# Altium schematic sheet Efuse.SchDoc
size A3
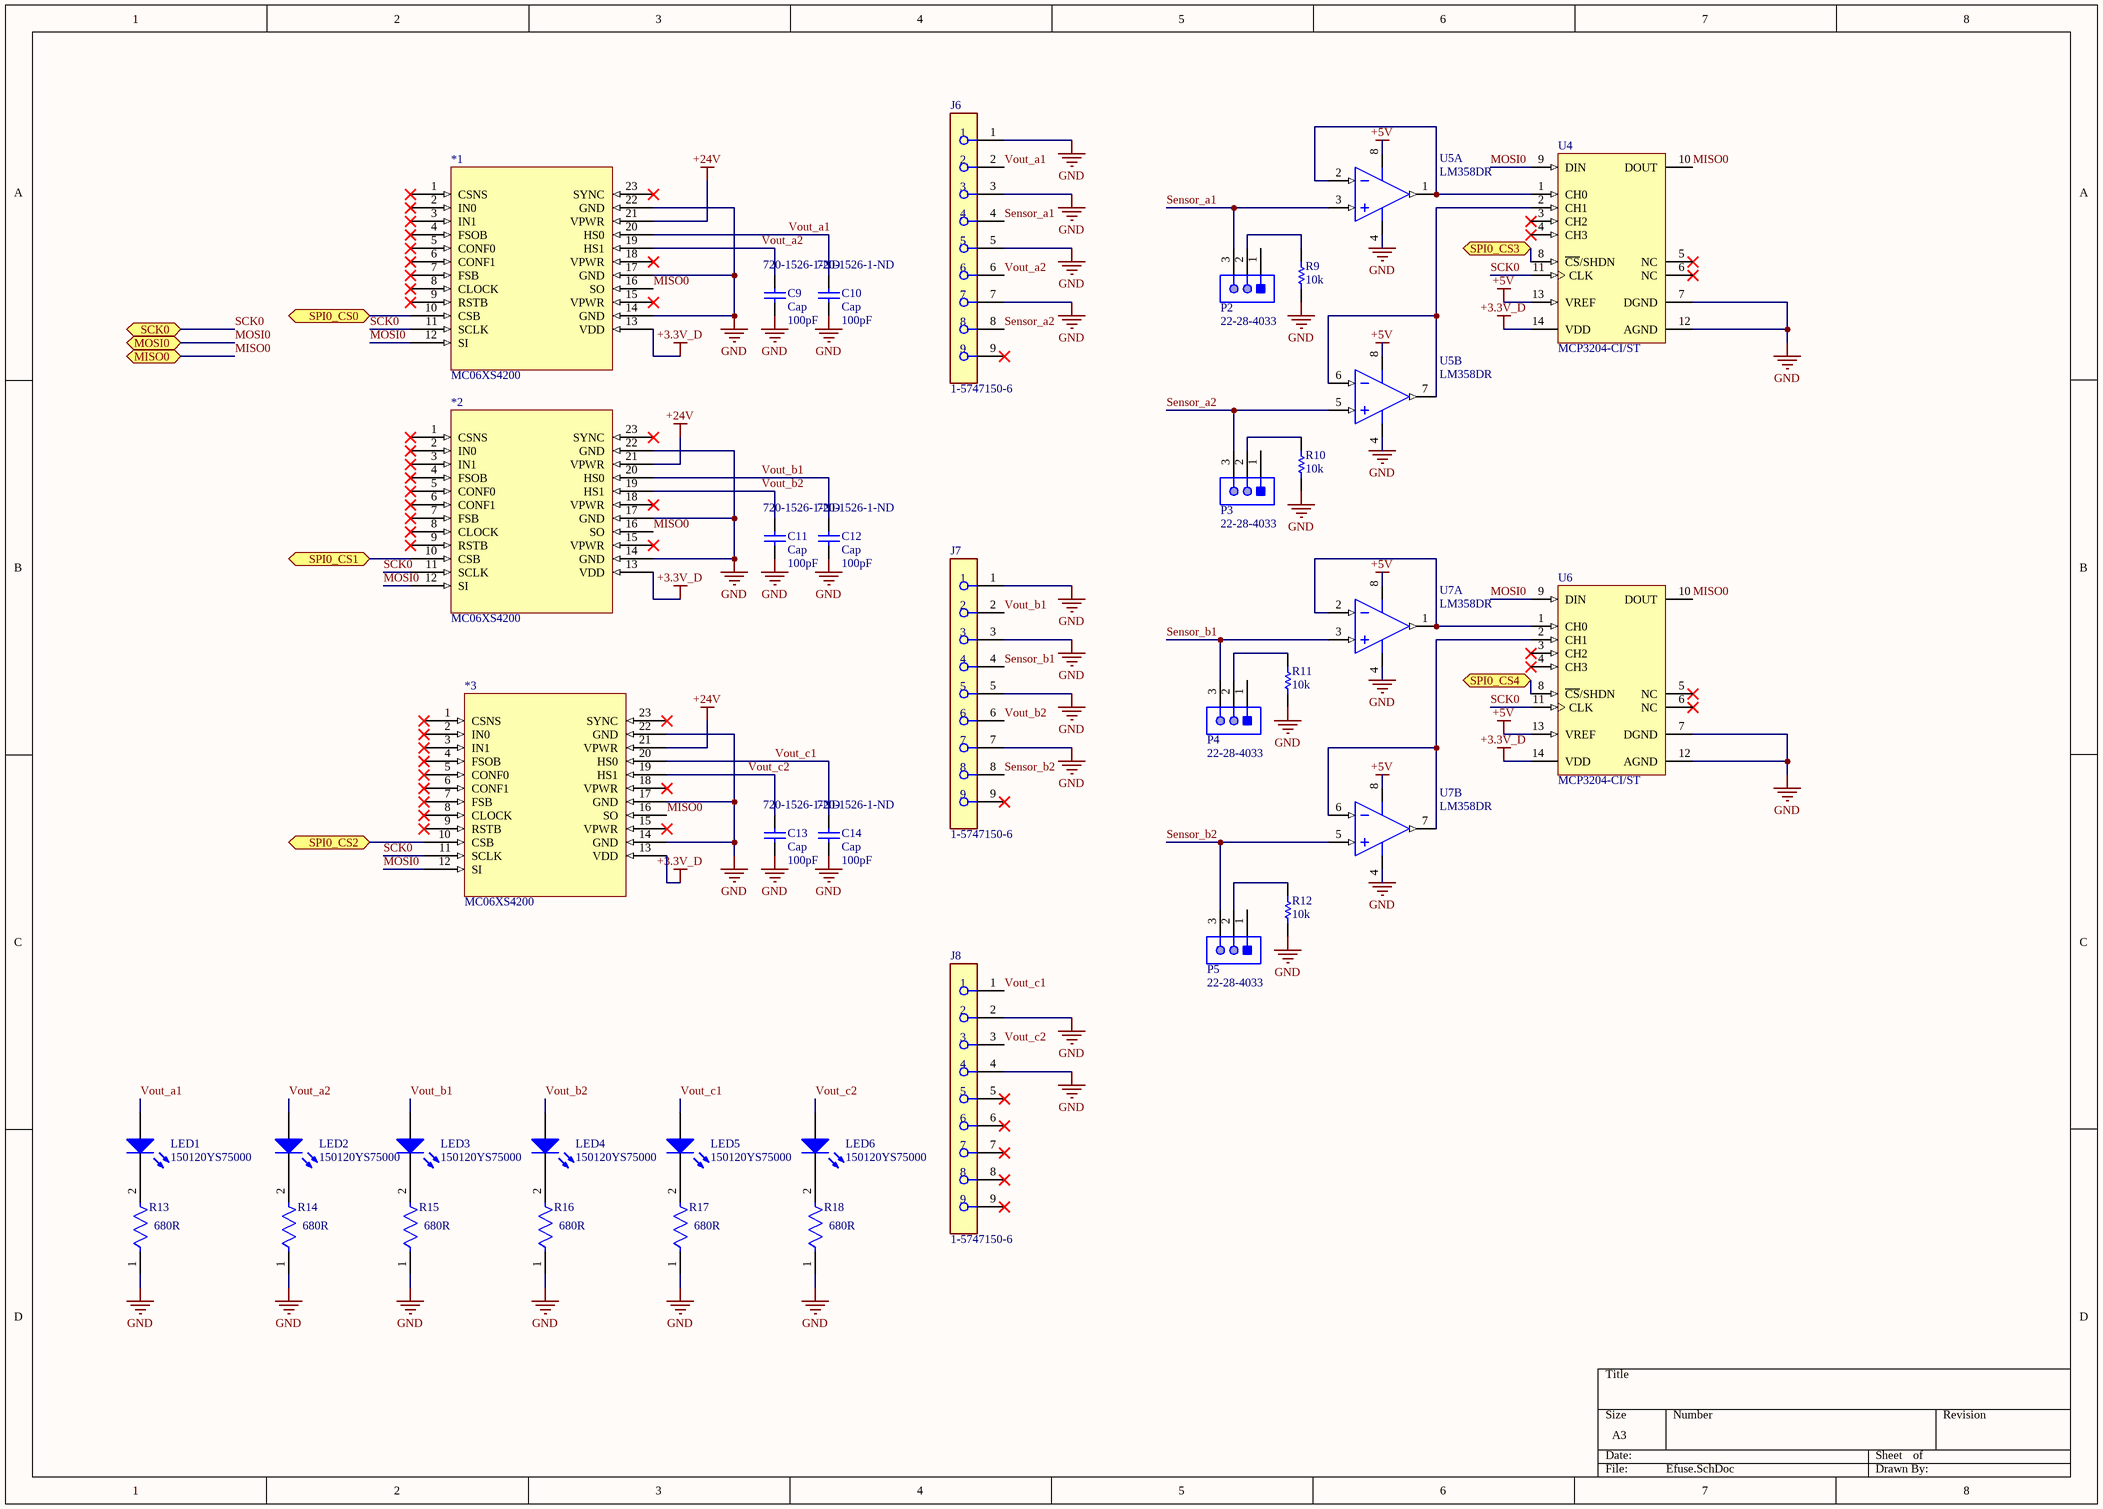
[diagram p0: Efuse.SchDoc]

## Parts
*1  MC06XS4200  [PQFN50P1200X1200X220_HS-33N]
*2  MC06XS4200  [PQFN50P1200X1200X220_HS-33N]
*3  MC06XS4200  [PQFN50P1200X1200X220_HS-33N]
C9  Cap  value 100pF  Supplier Part Number 1: 720-1526-1-ND  [CAPC1608X95X40LL15T15]
C10  Cap  value 100pF  Supplier Part Number 1: 720-1526-1-ND  [CAPC1608X95X40LL15T15]
C11  Cap  value 100pF  Supplier Part Number 1: 720-1526-1-ND  [CAPC1608X95X40LL15T15]
C12  Cap  value 100pF  Supplier Part Number 1: 720-1526-1-ND  [CAPC1608X95X40LL15T15]
C13  Cap  value 100pF  Supplier Part Number 1: 720-1526-1-ND  [CAPC1608X95X40LL15T15]
C14  Cap  value 100pF  Supplier Part Number 1: 720-1526-1-ND  [CAPC1608X95X40LL15T15]
J6  1-5747150-6  [FP-1-5747150-6-MFG]
J7  1-5747150-6  [FP-1-5747150-6-MFG]
J8  1-5747150-6  [FP-1-5747150-6-MFG]
LED1  150120YS75000  [1206_A]
LED2  150120YS75000  [1206_A]
LED3  150120YS75000  [1206_A]
LED4  150120YS75000  [1206_A]
LED5  150120YS75000  [1206_A]
LED6  150120YS75000  [1206_A]
P2  22-28-4033  [MOLX-22-28-4033_V]
P3  22-28-4033  [MOLX-22-28-4033_V]
P4  22-28-4033  [MOLX-22-28-4033_V]
P5  22-28-4033  [MOLX-22-28-4033_V]
R9  10k  [RESC1005X40X25NL05T05]
R10  10k  [RESC1005X40X25NL05T05]
R11  10k  [RESC1005X40X25NL05T05]
R12  10k  [RESC1005X40X25NL05T05]
R13  Resistance: 680R  [FP-CRCW0603-e3-MFG]  (hidden comment: CRCW0603680RFKEA)
R14  Resistance: 680R  [FP-CRCW0603-e3-MFG]  (hidden comment: CRCW0603680RFKEA)
R15  Resistance: 680R  [FP-CRCW0603-e3-MFG]  (hidden comment: CRCW0603680RFKEA)
R16  Resistance: 680R  [FP-CRCW0603-e3-MFG]  (hidden comment: CRCW0603680RFKEA)
R17  Resistance: 680R  [FP-CRCW0603-e3-MFG]  (hidden comment: CRCW0603680RFKEA)
R18  Resistance: 680R  [FP-CRCW0603-e3-MFG]  (hidden comment: CRCW0603680RFKEA)
U4  MCP3204-CI/ST  [TSSOP-ST14_N]
U5  LM358DR  [D0008A_L]  (parts A,B of 2)
U6  MCP3204-CI/ST  [TSSOP-ST14_N]
U7  LM358DR  [D0008A_L]  (parts A,B of 2)

## Ports
MISO0 (bidir), MOSI0 (bidir), SCK0 (bidir), SPI0_CS0 (bidir), SPI0_CS1 (bidir), SPI0_CS2 (bidir), SPI0_CS3 (bidir), SPI0_CS4 (bidir)

## Nets
+3.3V_D: *1.13(VDD) *2.13(VDD) *3.13(VDD) U4.14(VDD) U6.14(VDD)
+5V: U4.13(VREF) U5.8(VCC) U6.13(VREF) U7.8(VCC)
+24V: *1.21(VPWR) *2.21(VPWR) *3.21(VPWR)
GND: *1.14(GND) *1.17(GND) *1.22(GND) *2.14(GND) *2.17(GND) *2.22(GND) *3.14(GND) *3.17(GND) *3.22(GND) C9.1 C10.1 C11.1 C12.1 C13.1 C14.1 J6.1 J6.3 J6.5 J6.7 J7.1 J7.3 J7.5 J7.7 J8.2 J8.4 R9.1 R10.1 R11.1 R12.1 R13.1 R14.1 R15.1 R16.1 R17.1 R18.1 U4.7(DGND) U4.12(AGND) U5.4(GND) U6.7(DGND) U6.12(AGND) U7.4(GND)
MISO0: *1.16(SO) *2.16(SO) *3.16(SO) U4.10(DOUT) U6.10(DOUT) ; port MISO0
MOSI0: *1.12(SI) *2.12(SI) *3.12(SI) U4.9(DIN) U6.9(DIN) ; port MOSI0
SCK0: *1.11(SCLK) *2.11(SCLK) *3.11(SCLK) U4.11(CLK) U6.11(CLK) ; port SCK0
Sensor_a1: J6.4 P2.3 U5.3(1IN+)
Sensor_a2: J6.8 P3.3 U5.5(2IN+)
Sensor_b1: J7.4 P4.3 U7.3(1IN+)
Sensor_b2: J7.8 P5.3 U7.5(2IN+)
SPI0_CS0: *1.10(CSB) ; port SPI0_CS0
SPI0_CS1: *2.10(CSB) ; port SPI0_CS1
SPI0_CS2: *3.10(CSB) ; port SPI0_CS2
SPI0_CS3: U4.8(~{CS}/SHDN) ; port SPI0_CS3
SPI0_CS4: U6.8(~{CS}/SHDN) ; port SPI0_CS4
Vout_a1: *1.20(HS0) C10.2 J6.2 LED1.2(A)
Vout_a2: *1.19(HS1) C9.2 J6.6 LED2.2(A)
Vout_b1: *2.20(HS0) C12.2 J7.2 LED3.2(A)
Vout_b2: *2.19(HS1) C11.2 J7.6 LED4.2(A)
Vout_c1: *3.20(HS0) C14.2 J8.1 LED5.2(A)
Vout_c2: *3.19(HS1) C13.2 J8.3 LED6.2(A)
NetLED1_1: LED1.1(K) R13.2
NetLED2_1: LED2.1(K) R14.2
NetLED3_1: LED3.1(K) R15.2
NetLED4_1: LED4.1(K) R16.2
NetLED5_1: LED5.1(K) R17.2
NetLED6_1: LED6.1(K) R18.2
NetP2_2: P2.2 R9.2
NetP3_2: P3.2 R10.2
NetP4_2: P4.2 R11.2
NetP5_2: P5.2 R12.2
NetU4_1: U4.1(CH0) U5.1(1OUT) U5.2(1IN-)
NetU4_2: U4.2(CH1) U5.6(2IN-) U5.7(2OUT)
NetU6_1: U6.1(CH0) U7.1(1OUT) U7.2(1IN-)
NetU6_2: U6.2(CH1) U7.6(2IN-) U7.7(2OUT)

Not connected (* = marked no-connect by the designer): *1 1(CSNS)* 2(IN0)* 3(IN1)* 4(FSOB)* 5(CONF0)* 6(CONF1)* 7(FSB)* 8(CLOCK)* 9(RSTB)* 15(VPWR)* 18(VPWR)* 23(SYNC)*; *2 1(CSNS)* 2(IN0)* 3(IN1)* 4(FSOB)* 5(CONF0)* 6(CONF1)* 7(FSB)* 8(CLOCK)* 9(RSTB)* 15(VPWR)* 18(VPWR)* 23(SYNC)*; *3 1(CSNS)* 2(IN0)* 3(IN1)* 4(FSOB)* 5(CONF0)* 6(CONF1)* 7(FSB)* 8(CLOCK)* 9(RSTB)* 15(VPWR)* 18(VPWR)* 23(SYNC)*; J6 9*; J7 9*; J8 5* 6* 7* 8* 9*; P2 1; P3 1; P4 1; P5 1; U4 3(CH2)* 4(CH3)* 5(NC)* 6(NC)*; U6 3(CH2)* 4(CH3)* 5(NC)* 6(NC)*

## Library data of the parts
C9-C14 = Cap: MULTICOMP - MC0603F223Z500CT - KONDENSATOR, 0.022µF, 50V, Y5V, 0603; Tolerance: -20%; Capacitance: 22nF; Published: 8-Jun-2000; LatestRevisionDate: 17-Jul-2002; LatestRevisionNote: Re-released for DXP Platform.; PackageReference: RAD-0.3; Publisher: Altium Limited; PackageDescription: Radial Cap, Thru-Hole; 2 Leads; 0.3 in Pin Spacing; Manufacturer: Multicomp; Manufacturer Part Number: MC0603F223Z500CT; RoHS: Yes; Category: Capacitors; Stock 1: 9682; Pricing 1: 10=0.01100, 25=0.01100, 100=0.01100, 250=0.01100, 500=0.01100, 1000=0.01100 (CAD); Case/Package: 0603; Case Code (Metric): 1608; Case Code (Imperial): 0603; Min Operating Temperature: -30°C; Max Operating Temperature: 85°C; Packaging: Cut Tape; Voltage Rating (DC): 50V; Dielectric: Y5V; Voltage Rating: 50V; REACH SVHC: Unknown; ComponentLink1URL: https://datasheet.ciiva.com/46443/1870456-46443401.pdf?src-supplier=Element14; ComponentLink1Description: https://datasheet.ciiva.com/46443/1870456-46443401.pdf?src-supplier=Element14; ComponentLink2URL: https://datasheet.ciiva.com/46443/1870456-46443402.pdf?src-supplier=Element14; ComponentLink2Description: https://datasheet.ciiva.com/46443/1870456-46443402.pdf?src-supplier=Element14; Supplier 1: Digi-Key
J6-J8 = CMP-03367-000009-1: CONN D-SUB RCPT 9POS VERT SOLDER; Manufacturer: TE Connectivity; Is Female: yes; Current Rating: 6A; Conn Orientation: Vertical; Conn Gender: Female; Shielding: false; Number Of Contacts: 9; Pitch: 2.74mm; ComponentLink2URL: https://www.te.com/usa-en/product-1-5747150-6.html?te_bu=Cor&te_type=other&te_campaign=oct_glo_cor-oct-global-oth-prtnr-fy19-oct-octo-buy-bom_sma-298_2&elqCampaignId=35216; Manufacturer Part Number: 1-5747150-6; Temperature: -55°C to +105°C; Mouser Description: D-Sub Standard Connectors RECP FRNT MTL SHL 9P female screwlocks; Octopart: https://octopart.com/1-5747150-6-te+connectivity-39500344; Category: Conn; Automotive: No; Package: 1-5747150-6; Device Class L3: unset; Contact Material: Gold,Nickel; Lead Free: Yes; Height: 12.54mm; RoHS: TRUE; ComponentLink2Description: Datasheet; Device Class L2: D-Sub Connectors; Device Class L1: Connectors; Digikey Description: CONN D-SUB RCPT 9POS VERT SOLDER; Temperature Range High: +105°C; Temperature Range Low: -55°C
LED1-LED6 = CMP-1426-00019-1: SMD mono-color Chip LED, WL-SMCW, Yellow; Manufacturer: Wuerth Elektronik; ComponentLink2URL: http://katalog.we-online.com/led/datasheet/150120YS75000.pdf; PartNumber: 150120YS75000; ComponentLink1URL: http://www.we-online.com; Color: Yellow; ComponentLink1Description: Manufacturer URL; PackageReference: 1206_A; ComponentLink2Description: Datasheet
P2-P5 = CMP-1676-00001-5: Male Header, Pitch 2.54 mm, 1 x 3 Position, Height 8.38 mm, Tail Length 3.18 mm, RoHS, Bulk; Manufacturer: Molex; Rows: 1; Voltage Rating: 250 V; Current Rating: 4 A; Min Operating Temperature: 0 degC; Lead Pitch: 0.1 inch; Packaging: Bulk; Contact Finish: Gold; RoHSCompliant: true; Contact Material: Brass; PackageReference: 22-28-4033; REACH SVHC: Unknown; PackageDescription: Male Header, Pitch 2.54 mm, 1 x 3 Position, Height 8.38 mm, Tail Length 3.18 mm; ComponentLink2URL: http://www.molex.com/pdm_docs/sd/022284033_sd.pdf; Height: 8.38 mm; Mounting Technology: Through Hole; ComponentLink1Description: Manufacturer URL; Length: 7.62 mm; Mount: Through Hole; DatasheetVersion: Rev. G, 01/2012; Max Operating Temperature: 75 degC; ComponentLink2Description: Datasheet; Colour: Black; Pins: 3; Contact Plating: Gold; Package Quantity: 1; ComponentLink1URL: http://www.molex.com/
R9-R12 = CMP-2002-01183-1: Part Number: ERT-J0ER103J; Manufacturer: Panasonic
R13-R18 = CMP-02407-007120-1: RES Thick Film, 680Ω, 1%, 0.1W, 100ppm/°C, 0603; Voltage Rating (DC): 75V; Max Power Dissipation: 100mW; Radiation Hardening: No; Case Code (Imperial): 0603; Number of Pins: 2; Termination: SMD/SMT; Lead Free: Lead Free; Contact Plating: Tin; Case Code (Metric): 1608; Max Operating Temperature: 155°C; Tolerance: 1%; Military Standard: Not; Features: Automotive AEC-Q200; Power Rating: 100mW; Width: 0.85mm; Depth: 0.85mm; Height: 0.45mm; Case/Package: 0603; Min Operating Temperature: -55°C; Length: 1.55mm; Voltage Rating: 75V; Composition: Thick Film; Working Voltage: 75V; Temperature Coefficient: 100ppm/°C; Packaging: Tape and Reel; Package Quantity: 10; Weight: 7.1E-05oz; Number of Terminations: 2
U4 U6 = CMP-0188-00865-2: 2.7V 4-Channel/8-Channel 12-Bit A/D Converters with SPI Serial Interface, 14-Pin TSSOP, C Performance Grade, Industrial Temperature; ComponentLink1URL: http://www.microchip.com/; ComponentLink1Description: Manufacturer URL; PackageVersion: revBB, Aug-2009; ComponentLink2Description: Datasheet; DatasheetVersion: revE, Sep-2008; ComponentLink2URL: http://ww1.microchip.com/downloads/en/DeviceDoc/21298e.pdf; ComponentLink3URL: http://www.microchip.com/stellent/groups/techpub_sg/documents/packagingspec/en012702.pdf; PackageDescription: 14-Lead Plastic Thin Shrink Small Outline (ST) - 4.4mm Body [TSSOP]; PackageReference: TSSOP-ST14; ComponentLink3Description: Package Specification; RevisionNote: URLs added.
U5 U7 = CMP-1685-00009-1: Dual Operational Amplifier, 3 to 32 V, 0 to 70 degC, 8-Pin SOIC (D), Green (RoHS & no Sb/Br), Tape and Reel; DatasheetVersion: SLOS068T, 04/2015; ComponentLink1URL: http://www.ti.com/; ComponentLink2URL: http://www.ti.com/lit/ds/symlink/lm358.pdf; ComponentLink3Description: Package Specification; Code_JEDEC: MS-012; PackageDescription: 8-Pin Small Outline Integrated Circuit, Body 4.9 x 3.9 mm, Pitch 1.27 mm; ComponentLink2Description: Datasheet; PackageVersion: 4040047-3/M, 06/2011; ComponentLink1Description: Manufacturer URL; ComponentLink3URL: http://www.ti.com/lit/ml/msoi002j/msoi002j.pdf; PackageReference: D0008A